# Altium schematic sheet output.SchDoc
size A; SheetNumber: 3; SheetTotal: 3
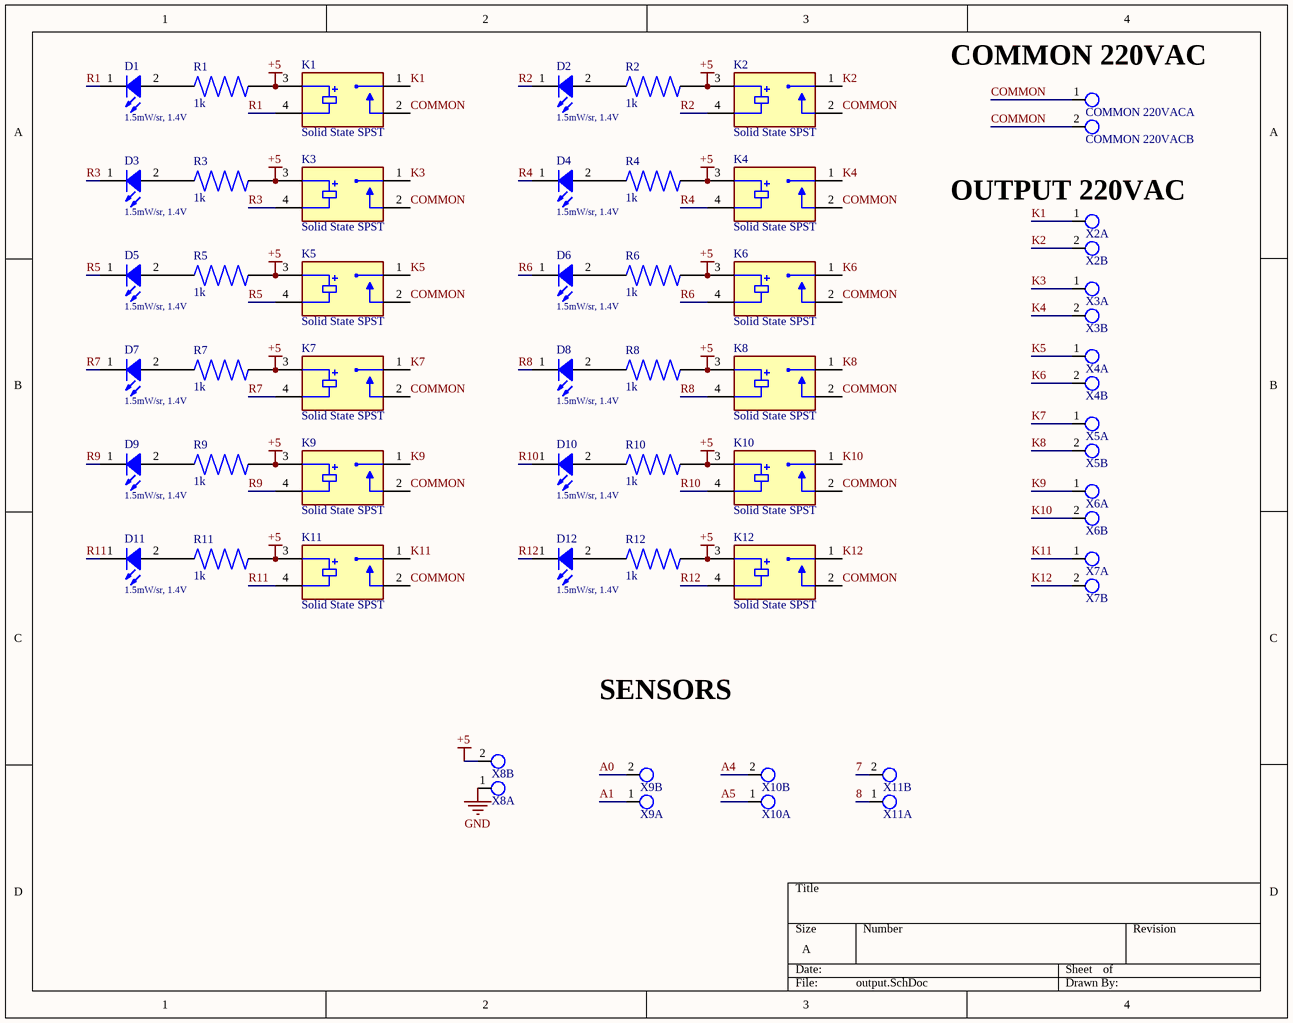
[diagram p0: output.SchDoc]

## Parts
COMMON_220VAC  AK300/2  [AK300/2]  (value not drawn)  (parts A,B of 2)
D1  1.5mW/sr, 1.4V  [0805_L2W1.3H0.8]
D2  1.5mW/sr, 1.4V  [0805_L2W1.3H0.8]
D3  1.5mW/sr, 1.4V  [0805_L2W1.3H0.8]
D4  1.5mW/sr, 1.4V  [0805_L2W1.3H0.8]
D5  1.5mW/sr, 1.4V  [0805_L2W1.3H0.8]
D6  1.5mW/sr, 1.4V  [0805_L2W1.3H0.8]
D7  1.5mW/sr, 1.4V  [0805_L2W1.3H0.8]
D8  1.5mW/sr, 1.4V  [0805_L2W1.3H0.8]
D9  1.5mW/sr, 1.4V  [0805_L2W1.3H0.8]
D10  1.5mW/sr, 1.4V  [0805_L2W1.3H0.8]
D11  1.5mW/sr, 1.4V  [0805_L2W1.3H0.8]
D12  1.5mW/sr, 1.4V  [0805_L2W1.3H0.8]
K1  Solid State SPST  [Solid State SPST]
K2  Solid State SPST  [Solid State SPST]
K3  Solid State SPST  [Solid State SPST]
K4  Solid State SPST  [Solid State SPST]
K5  Solid State SPST  [Solid State SPST]
K6  Solid State SPST  [Solid State SPST]
K7  Solid State SPST  [Solid State SPST]
K8  Solid State SPST  [Solid State SPST]
K9  Solid State SPST  [Solid State SPST]
K10  Solid State SPST  [Solid State SPST]
K11  Solid State SPST  [Solid State SPST]
K12  Solid State SPST  [Solid State SPST]
R1  value 1k  [1206]  (hidden comment: 1206 Res)
R2  value 1k  [1206]  (hidden comment: 1206 Res)
R3  value 1k  [1206]  (hidden comment: 1206 Res)
R4  value 1k  [1206]  (hidden comment: 1206 Res)
R5  value 1k  [1206]  (hidden comment: 1206 Res)
R6  value 1k  [1206]  (hidden comment: 1206 Res)
R7  value 1k  [1206]  (hidden comment: 1206 Res)
R8  value 1k  [1206]  (hidden comment: 1206 Res)
R9  value 1k  [1206]  (hidden comment: 1206 Res)
R10  value 1k  [1206]  (hidden comment: 1206 Res)
R11  value 1k  [1206]  (hidden comment: 1206 Res)
R12  value 1k  [1206]  (hidden comment: 1206 Res)
X2  AK300/2  [AK300/2]  (value not drawn)  (parts A,B of 2)
X3  AK300/2  [AK300/2]  (value not drawn)  (parts A,B of 2)
X4  AK300/2  [AK300/2]  (value not drawn)  (parts A,B of 2)
X5  AK300/2  [AK300/2]  (value not drawn)  (parts A,B of 2)
X6  AK300/2  [AK300/2]  (value not drawn)  (parts A,B of 2)
X7  AK300/2  [AK300/2]  (value not drawn)  (parts A,B of 2)
X8  AK300/2  [AK300/2]  (value not drawn)  (parts A,B of 2)
X9  AK300/2  [AK300/2]  (value not drawn)  (parts A,B of 2)
X10  AK300/2  [AK300/2]  (value not drawn)  (parts A,B of 2)
X11  AK300/2  [AK300/2]  (value not drawn)  (parts A,B of 2)

## Nets
+5: K1.3 K2.3 K3.3 K4.3 K5.3 K6.3 K7.3 K8.3 K9.3 K10.3 K11.3 K12.3 R1.2 R2.2 R3.2 R4.2 R5.2 R6.2 R7.2 R8.2 R9.2 R10.2 R11.2 R12.2 X8.2(KL)
GND: X8.1(KL)
7: X11.2(KL)
8: X11.1(KL)
A0: X9.2(KL)
A1: X9.1(KL)
A4: X10.2(KL)
A5: X10.1(KL)
COMMON: COMMON_220VAC.1(KL) COMMON_220VAC.2(KL) K1.2 K2.2 K3.2 K4.2 K5.2 K6.2 K7.2 K8.2 K9.2 K10.2 K11.2 K12.2
K1: K1.1 X2.1(KL)
K2: K2.1 X2.2(KL)
K3: K3.1 X3.1(KL)
K4: K4.1 X3.2(KL)
K5: K5.1 X4.1(KL)
K6: K6.1 X4.2(KL)
K7: K7.1 X5.1(KL)
K8: K8.1 X5.2(KL)
K9: K9.1 X6.1(KL)
K10: K10.1 X6.2(KL)
K11: K11.1 X7.1(KL)
K12: K12.1 X7.2(KL)
R1: D1.1(K) K1.4
R2: D2.1(K) K2.4
R3: D3.1(K) K3.4
R4: D4.1(K) K4.4
R5: D5.1(K) K5.4
R6: D6.1(K) K6.4
R7: D7.1(K) K7.4
R8: D8.1(K) K8.4
R9: D9.1(K) K9.4
R10: D10.1(K) K10.4
R11: D11.1(K) K11.4
R12: D12.1(K) K12.4
NetD1_2: D1.2(A) R1.1
NetD2_2: D2.2(A) R2.1
NetD3_2: D3.2(A) R3.1
NetD4_2: D4.2(A) R4.1
NetD5_2: D5.2(A) R5.1
NetD6_2: D6.2(A) R6.1
NetD7_2: D7.2(A) R7.1
NetD8_2: D8.2(A) R8.1
NetD9_2: D9.2(A) R9.1
NetD10_2: D10.2(A) R10.1
NetD11_2: D11.2(A) R11.1
NetD12_2: D12.2(A) R12.1

## Notes on the sheet
- (near COMMON_220VAC) COMMON 220VAC
- (near X2) OUTPUT 220VAC
- SENSORS

## Library data of the parts
COMMON_220VAC X2-X11 = AK300/2: MP: AK300/3; MF: Altech; Package: None; Availability: Unavailable; SnapEDA_Link: https://www.snapeda.com/parts/AK300/3/Altech/view-part/2748485/?ref=snap; Check_prices: https://www.snapeda.com/parts/AK300/3/Altech/view-part/2748485/?ref=eda; Value: *; Price: None
D1-D12 = 0805 Led: WL-SICW SMT Chip LED Infrared Waterclear, size 0805, 1.5mW/sr, 1.4V; Manufacturer Part Number: 15408085BA400; Manufacturer: Wurth Elektronik; Chip Technology: AlGaAs; Forward Voltage max.: 2V; Centroid Wavelength typ.: 845nm; Peak Wavelength typ.: 850nm; Radiant Intensity min.: 0.6mW/sr; Viewing Angle: 140deg; Radiant Intensity typ.: 1.5mW/sr; ComponentLink1Description: Manufacturer; ComponentLink1URL: http://www.we-online.de; ComponentLink2URL: https://www.we-online.com/catalog/datasheet/15408085BA400.pdf; ComponentLink2Description: Datasheet; Emitting Color: Infrared; Forward Voltage typ.: 1.4V; Mounting Technology: SMT; Operating Temperature: -40 to +85degC; Published Date: August 2020; Packaging: Tape and Reel; Size: 0805
K1-K12 = Solid State SPST: Solid State SPST-NO (1 Form A) 4-SIP; MF: Omron Automation; MP: G3MB-202P DC5; Price: None; SnapEDA_Link: https://www.snapeda.com/parts/G3MB-202P%20DC5/Omron%20Automation%20and%20Safety/view-part/914581/?ref=snap; Value: *; Package: SIP-4 Omron; Availability: Unavailable
R1-R12 = 1206 Res: Res 1206 10 Ohm 5% 1/8W Â±500ppm/Â°C Molded SMD SMD T/R; Resistance: 10; MP: FCR1206J10R; Power_Rating: .125 W; MF: TE Connectivity; DigiKey-Purchase-URL: https://snapeda.com/shop?store=DigiKey&id=988597; Package: 1206; EU_RoHS_Compliance: Compliant with Exemptions; Tolerance: 5%; Price: None; SnapEDA_Link: https://www.snapeda.com/parts/FCR1206J10R/TE%20Connectivity%20Passive%20Product/view-part/988597/?ref=snap; Mouser-Purchase-URL: https://snapeda.com/shop?store=Mouser&id=988597; Availability: Warning